# Altium schematic sheet I2C_Devices.SchDoc
size A4; SheetNumber: 4; SheetTotal: 11
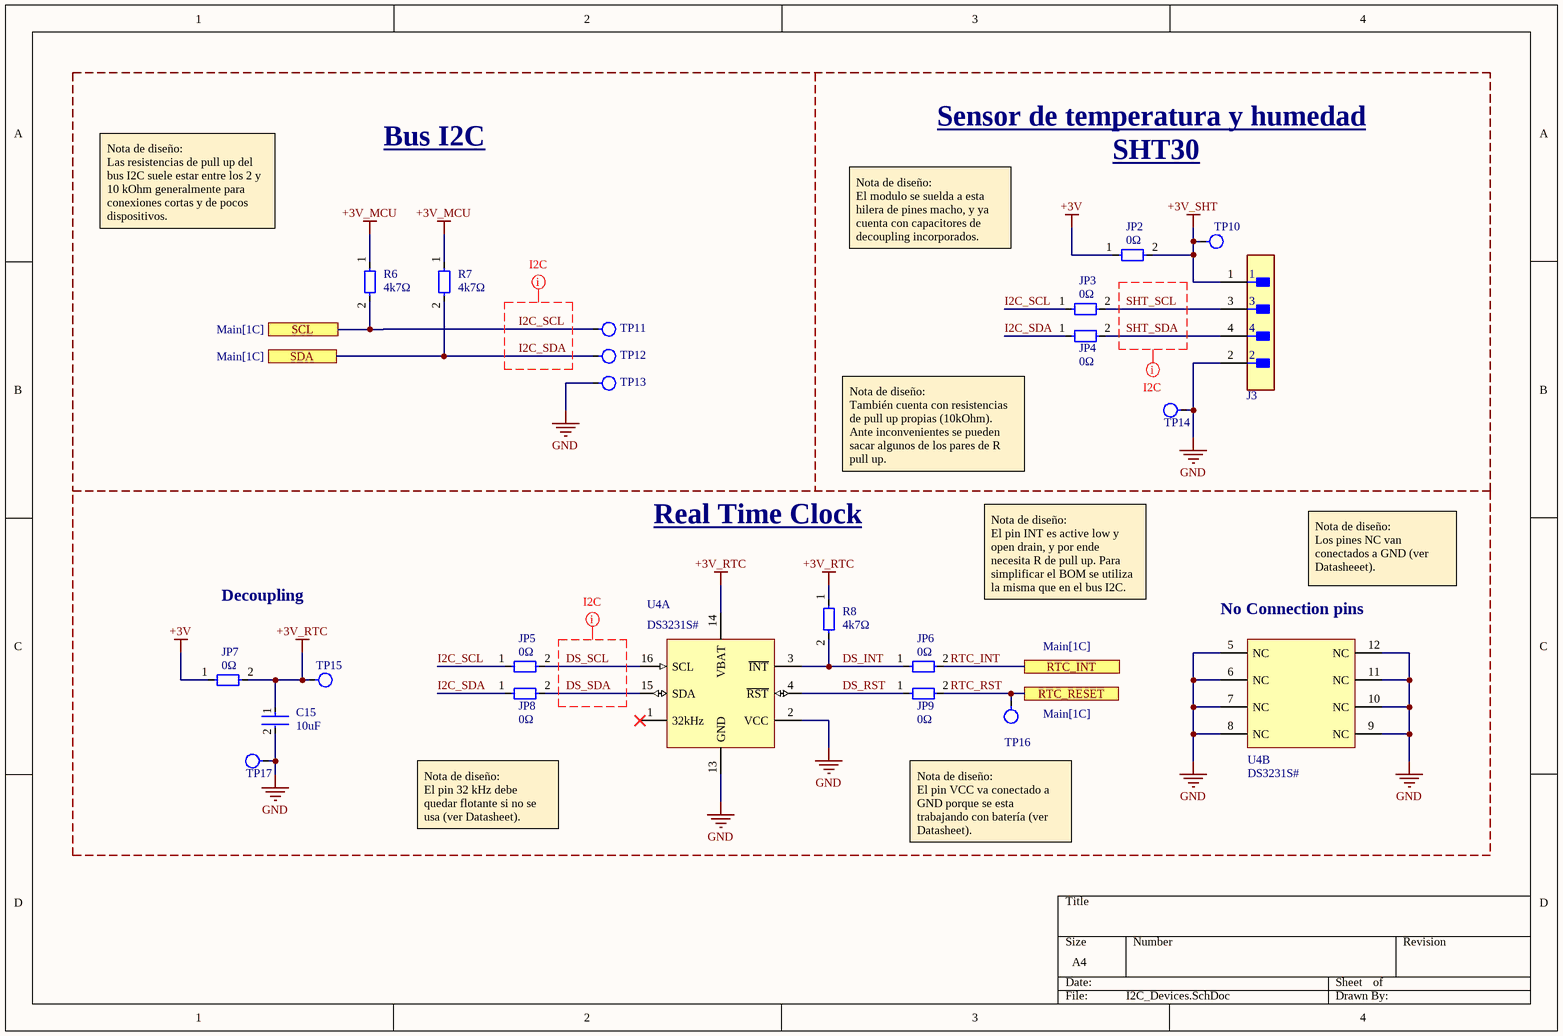
[diagram p0: I2C_Devices.SchDoc]

## Parts
C15  10uF  [CAP_0603]
J3  HTSW-104-07-G-S  [FP-HTSW-104-07-G-S-MFG]  (value not drawn)
JP2  value 0Ω  [RES_0R_0603]  (hidden comment: Generic JP)  (no BOM)
JP3  value 0Ω  [RES_0R_0603]  (hidden comment: Generic JP)  (no BOM)
JP4  value 0Ω  [RES_0R_0603]  (hidden comment: Generic JP)  (no BOM)
JP5  value 0Ω  [RES_0R_0603]  (hidden comment: Generic JP)  (no BOM)
JP6  value 0Ω  [RES_0R_0603]  (hidden comment: Generic JP)  (no BOM)
JP7  value 0Ω  [RES_0R_0603]  (hidden comment: Generic JP)  (no BOM)
JP8  value 0Ω  [RES_0R_0603]  (hidden comment: Generic JP)  (no BOM)
JP9  value 0Ω  [RES_0R_0603]  (hidden comment: Generic JP)  (no BOM)
R6  value 4k7Ω  [RES_0603]  (hidden comment: 4k7)
R7  value 4k7Ω  [RES_0603]  (hidden comment: 4k7)
R8  value 4k7Ω  [RES_0603]  (hidden comment: 4k7)
TP10  Testpoint SMD  [Testpoint_SMD]  (value not drawn)  (no BOM)
TP11  Testpoint SMD  [Testpoint_SMD]  (value not drawn)  (no BOM)
TP12  Testpoint SMD  [Testpoint_SMD]  (value not drawn)  (no BOM)
TP13  Testpoint SMD  [Testpoint_SMD]  (value not drawn)  (no BOM)
TP14  Testpoint SMD  [Testpoint_SMD]  (value not drawn)  (no BOM)
TP15  Testpoint SMD  [Testpoint_SMD]  (value not drawn)  (no BOM)
TP16  Testpoint SMD  [Testpoint_SMD]  (value not drawn)  (no BOM)
TP17  Testpoint SMD  [Testpoint_SMD]  (value not drawn)  (no BOM)
U4  DS3231S#  [SOIC_16_M]  (parts A,B of 2)

## Ports
RTC_INT (see Main[1C]), RTC_RESET (see Main[1C]), SCL (see Main[1C]), SDA (see Main[1C])

## Nets
+3V: JP2.1 JP7.1
+3V_MCU: R6.1 R7.1
+3V_RTC: C15.1 JP7.2 R8.1 TP15.1 U4.14(VBAT)
+3V_SHT: J3.1 JP2.2 TP10.1
GND: C15.2 J3.2 TP13.1 TP14.1 TP17.1 U4.2(VCC) U4.5(NC) U4.6(NC) U4.7(NC) U4.8(NC) U4.9(NC) U4.10(NC) U4.11(NC) U4.12(NC) U4.13(GND)
DS_INT: JP6.1 R8.2 U4.3(~{INT})
DS_RST: JP9.1 U4.4(~{RST})
DS_SCL: JP5.2 U4.16(SCL)
DS_SDA: JP8.2 U4.15(SDA)
I2C_SCL: JP3.1 JP5.1 R6.2 TP11.1 ; port SCL
I2C_SDA: JP4.1 JP8.1 R7.2 TP12.1 ; port SDA
RTC_INT: JP6.2 ; port RTC_INT
RTC_RST: JP9.2 TP16.1 ; port RTC_RESET
SHT_SCL: J3.3 JP3.2
SHT_SDA: J3.4 JP4.2

Not connected (* = marked no-connect by the designer): U4 1(32kHz)*

## Layout directives
net class I2C: DS_SCL, DS_SDA, I2C_SCL, I2C_SDA, SHT_SCL, SHT_SDA

## Notes on the sheet
- Bus I2C
- Sensor de temperatura y humedad
- SHT30
- Nota de diseño:
  Las resistencias de pull up del bus I2C suele estar entre los 2 y 10 kOhm generalmente para conexiones cortas y de pocos dispositivos.
- Nota de diseño:
  El modulo se suelda a esta hilera de pines macho, y ya cuenta con capacitores de decoupling incorporados.
- Nota de diseño:
  También cuenta con resistencias de pull up propias (10kOhm). Ante inconvenientes se pueden sacar algunos de los pares de R pull up.
- Real Time Clock
- Nota de diseño:
  Los pines NC van conectados a GND (ver Datasheeet).
- Decoupling
- Nota de diseño:
  El pin INT es active low y open drain, y por ende necesita R de pull up. Para simplificar el BOM se utiliza la misma que en el bus I2C.
- (near U4) No Connection pins
- Nota de diseño:
  El pin 32 kHz debe quedar flotante si no se usa (ver Datasheet).
- Nota de diseño:
  El pin VCC va conectado a GND porque se esta trabajando con batería (ver Datasheet).

## Library data of the parts
C15 = Generic C: Cap 10  uF 10V X7R 0603; Dielectric: X5R; Tolerance: 10%; Case Code (Imperial): 0805; Capacitance: 10uF; Mount: Surface Mount; Depth: 1.25mm; Length: 2mm; Lead Free: Lead Free; Packaging: Tape and Reel; Width: 0.049inch; Package Quantity: 1; Height: 1.25mm; Case/Package: 0805; Voltage Rating: 10V; Thickness: 0.053inch; Max Operating Temperature: 85°C; Case Code (Metric): 2012; Contact Plating: Tin; Min Operating Temperature: -55°C; Radiation Hardening: No; Voltage Rating (DC): 10V
J3 = CMP-02766-001776_ALT: CONN HEADER VERT 4POS 2.54MM. Versión alterna.; Gender: Male; Number of Contacts: 4; Pitch: 2.54mm; Packaging: Bulk; RoHS Compliant: Yes; Number of Rows: 1; Mount: Through Hole; Contact Material: Bronze; Series: HTSW; Radiation Hardening: No; Reach SVHC Compliant: Yes; Contact Plating: Gold; Termination: Through Hole
JP2-JP9 = Generic JP: Simbolo de jumper genérico
R6-R8 = Generic R: RES  4k7 1% 0603
TP10-TP17 = Testpoint_SMD: Testpoint SMD de 1mm de diametro.
U4 = DS3231S# for battery use: IC RTC CLK/CALENDAR I2C 16SOIC. Symbol used with battery as the main supply voltage.